# Altium schematic sheet Sheet1.SchDoc
size 203 x 228 mm; Author: SFerret; CompanyName: JMU; DrawnBy: SFerret; Engineer: NZY; SheetNumber: 1; SheetTotal: 1
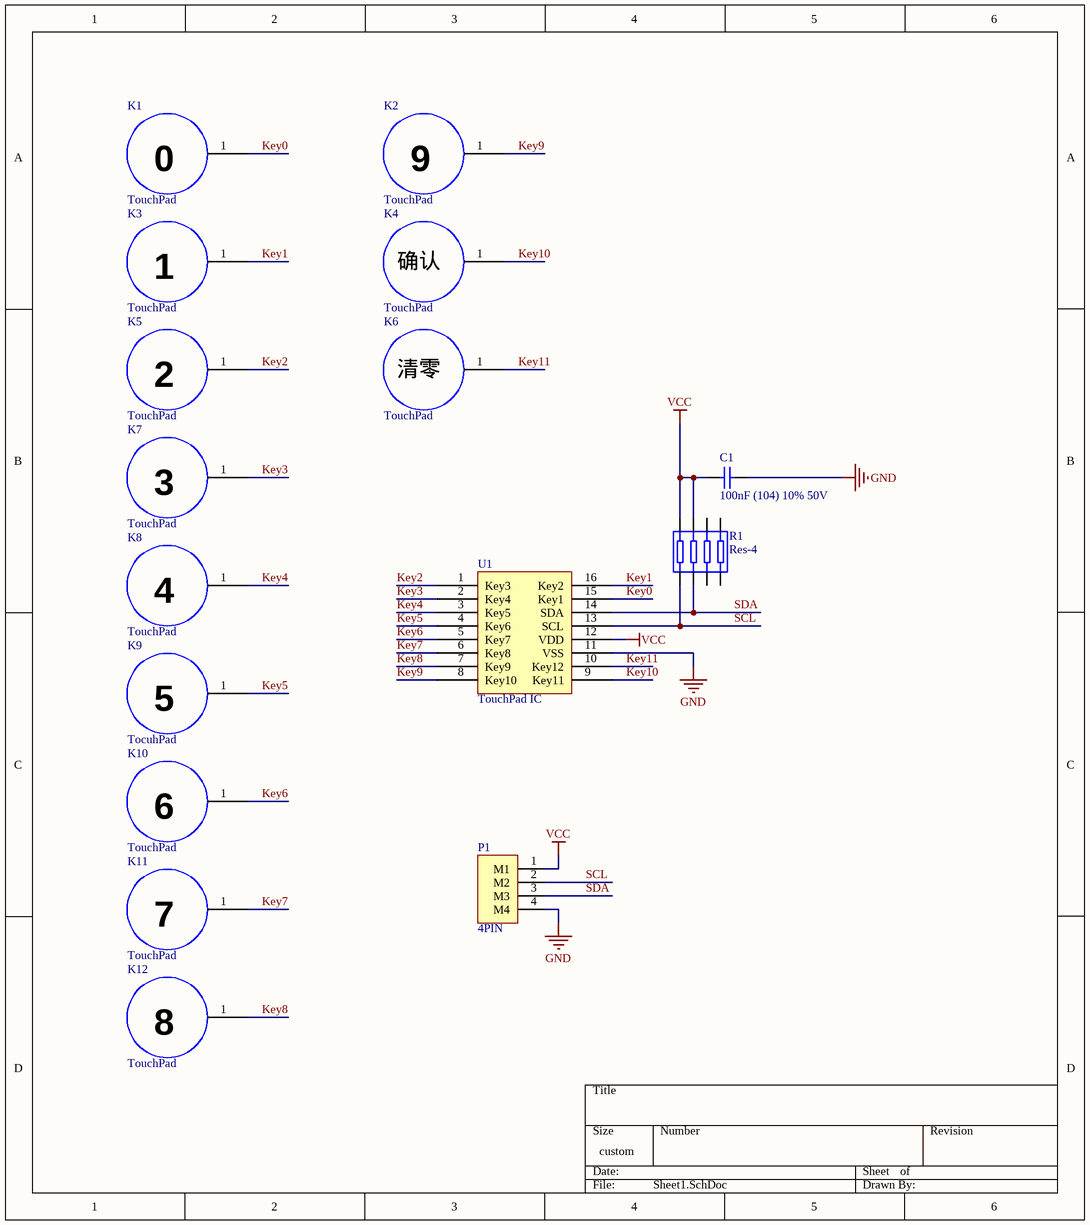
[diagram p0: Sheet1.SchDoc]

## Parts
C1  100nF (104) 10% 50V  [0603_C]
K1  TouchPad  [KEY0]
K2  TouchPad  [KEY9]
K3  TouchPad  [Key1]
K4  TouchPad  [confirm]
K5  TouchPad  [KEY2]
K6  TouchPad  [concel]
K7  TouchPad  [KEY3]
K8  TouchPad  [KEY4]
K9  TocuhPad  [KEY5]
K10  TouchPad  [KEY6]
K11  TouchPad  [KEY7]
K12  TouchPad  [KEY8]
P1  4PIN  [PH2.0WS-4P]
R1  Res-4  [res-4]
U1  TouchPad IC  [SOP127P600X175-16N]

## Nets
GND: C1.2 P1.4(M4) U1.11(VSS)
VCC: C1.1 P1.1(M1) R1.3 R1.4 U1.12(VDD)
Key0: K1.1 U1.15(Key1)
Key1: K3.1 U1.16(Key2)
Key2: K5.1 U1.1(Key3)
Key3: K7.1 U1.2(Key4)
Key4: K8.1 U1.3(Key5)
Key5: K9.1 U1.4(Key6)
Key6: K10.1 U1.5(Key7)
Key7: K11.1 U1.6(Key8)
Key8: K12.1 U1.7(Key9)
Key9: K2.1 U1.8(Key10)
Key10: K4.1 U1.9(Key11)
Key11: K6.1 U1.10(Key12)
SCL: P1.2(M2) R1.5 U1.13(SCL)
SDA: P1.3(M3) R1.6 U1.14(SDA)

Not connected (* = marked no-connect by the designer): R1 1 2 7 8

## Notes on the sheet
- (in symbol cancel) 清零
- (in symbol confirm) 确认
- (in symbol Key0) 0
- (in symbol Key2) 2
- (in symbol Key3) 3
- (in symbol key4) 4
- (in symbol Key5) 5
- (in symbol Key6) 6
- (in symbol Key7) 7
- (in symbol Key8) 8
- (in symbol Key9) 9

## Library data of the parts
C1 = 0603 100nF (104) 10% 50V: 贴片电容; ComponentLink1Description: 供应商链接; ComponentLink1URL: http://www.szlcsc.com/product/details_15331.html; Package: 0603; Supplier: LC; SuppliersPartNumber: C14663
K1 = Key0
K2 = Key9
K3 = Key1
K4 = confirm
K5 = Key2
K6 = cancel
K7 = Key3
K8 = key4
K9 = Key5
K10 = Key6
K11 = Key7
K12 = Key8
P1 = 接线端子-4PIN
R1 = Res-4: 排阻
U1 = BS8112A-3